# EAGLE schematic V0.2a (EAGLE 8.6.2)

## Sheet 1 of 3: This sheet contain connections for Power Source and +3.3 V regulator to enable communication.
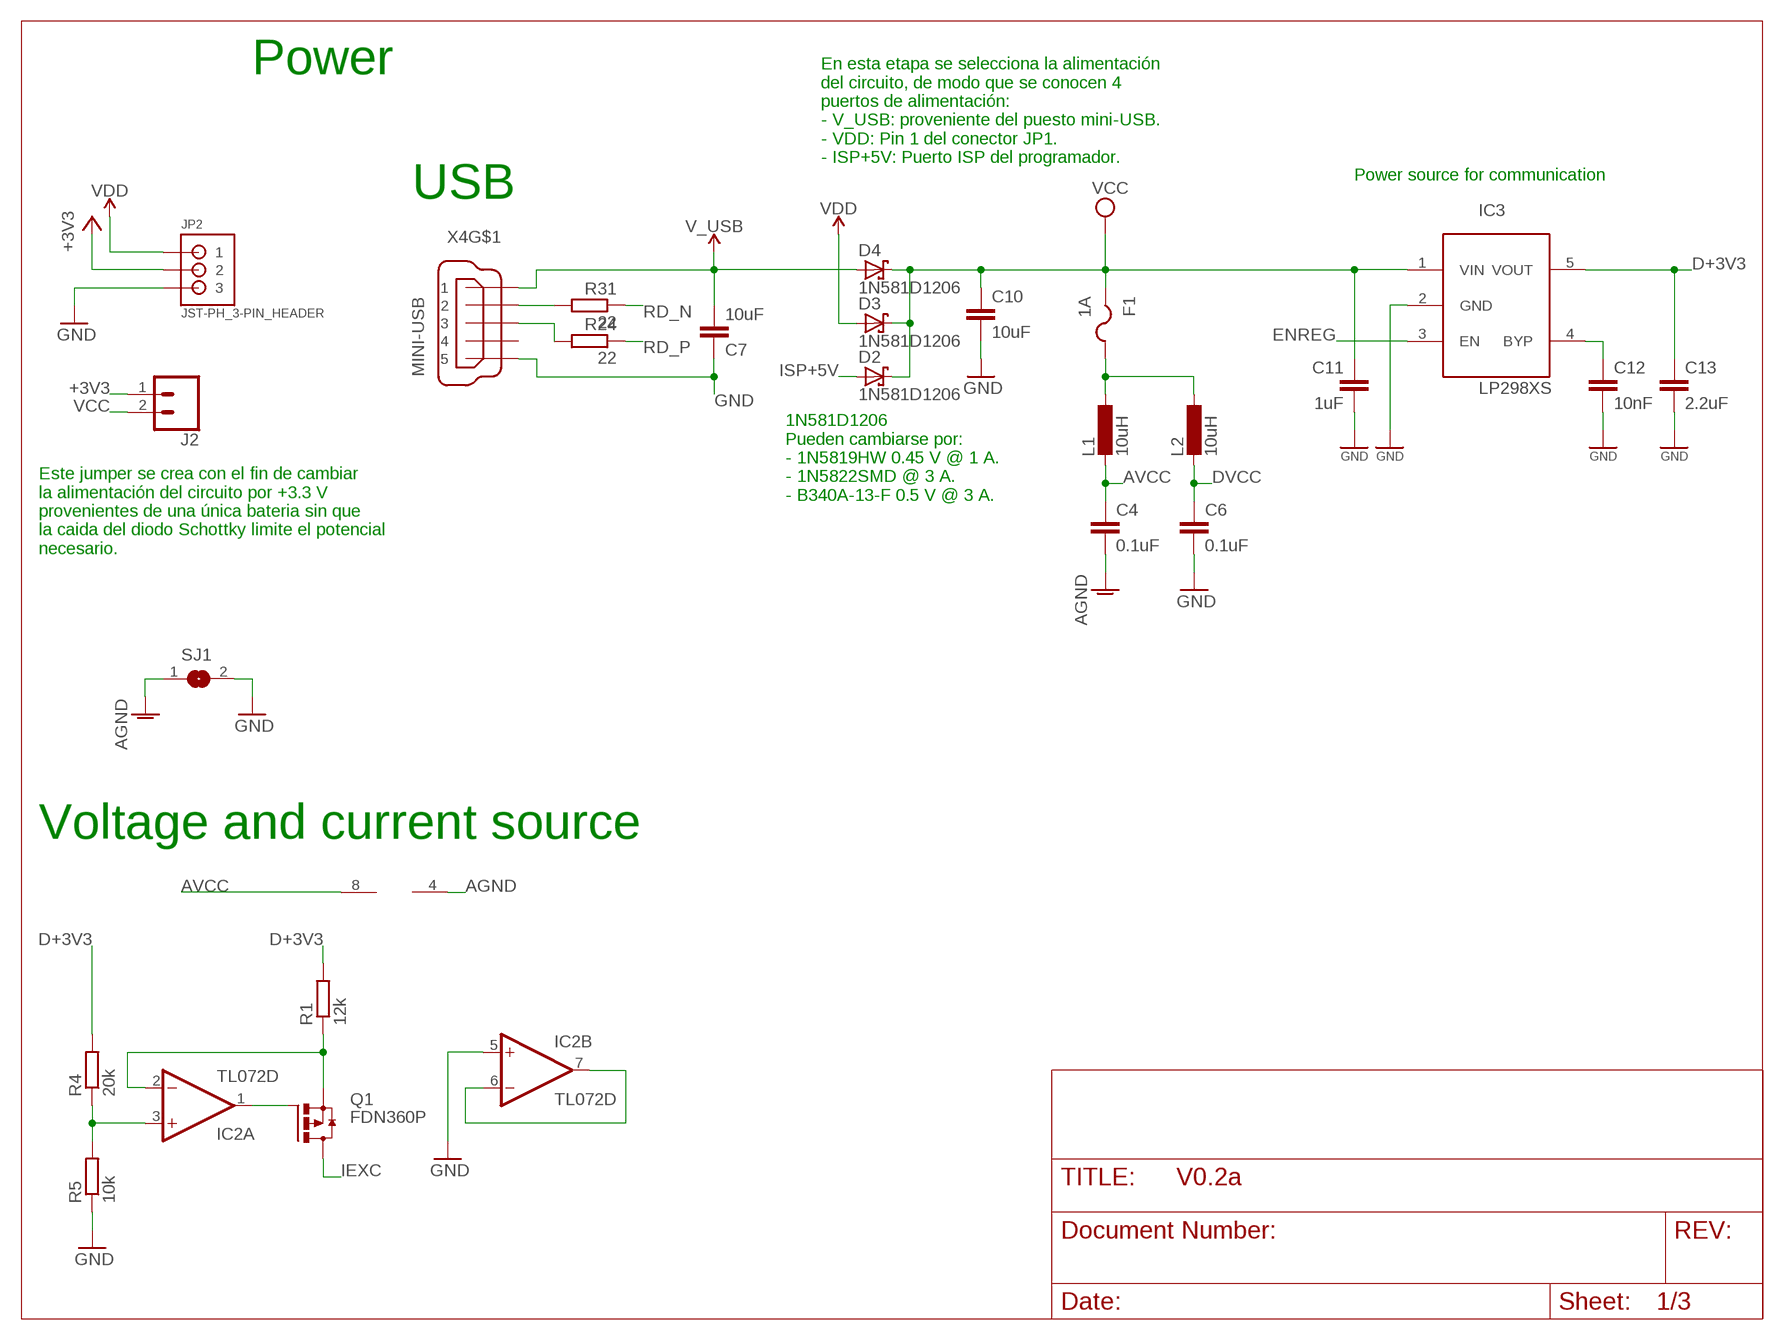
[diagram p0: schematic, sheet 1]

### Parts
C4  0.1uF  C-EUC0805  [C0805]
C6  0.1uF  C-EUC0805  [C0805]
C7  10uF  C-EUC0805  [C0805]
C10  10uF  C-EUC1206  [C1206]
C11  1uF  C-EUC0805  [C0805]
C12  10nF  C-EUC0805  [C0805]
C13  2.2uF  C-EUC0805  [C0805]
D2  1N581D1206  [LED-1206]
D3  1N581D1206  [LED-1206]
D4  1N581D1206  [LED-1206]
F1  1A  PTCFUSE-1812  [1812]
IC2  TL072D  [SO08]
IC3  LP298XS  [SOT23-5L]
J2  CONN_02  [1X02]
JP2  JST-PH_3-PIN_HEADER  [JST_B3B-PH_HEADER]
L1  10uH  L-EUL1812  [L1812]
L2  10uH  L-EUL1812  [L1812]
Q1  FDN360P  [SUPER-SOT3]
R1  12k  R-EU_R0805  [R0805]
R4  20k  R-EU_R0805  [R0805]
R5  10k  R-EU_R0805  [R0805]
R24  22  R-EU_R0805  [R0805]
R31  22  R-EU_R0805  [R0805]
SJ1  SJ  [SJ]
X4  MINI-USB  MINI-USB-SCHIELD-32005-201  [32005-201]

### Nets
+3V3 [power]: J2.1 JP2.P2
AGND: C4.2 IC2.4(P:V-) SJ1.1 ; also sheet 2
AVCC: C4.1 IC2.8(P:V+) L1.2
D+3V3 [power]: C13.1 IC3.5(VOUT) R1.2 R4.2 ; also sheet 2,3
D+USB: R24.2 X4.3
D-USB: R31.2 X4.2
DVCC: C6.1 L2.2 ; also sheet 2,3
ENREG: IC3.3(EN) ; also sheet 3
GND [power]: C6.2 C7.1 C10.2 C11.2 C12.2 C13.2 IC2.5(B:+IN) IC3.2(GND) JP2.P3 R5.1 SJ1.2 X4.5 ; also sheet 2,3
IEXC: Q1.3(D) ; also sheet 2
ISP+5V [power]: D2.A ; also sheet 3
N$1 [power]: F1.2 L1.1 L2.1
N$2: IC2.1(A:OUT) Q1.1(G)
N$4: IC2.3(A:+IN) R4.1 R5.2
N$5: IC2.2(A:-IN) Q1.2(S) R1.1
N$6: C12.1 IC3.4(BYP)
N$8: IC2.6(B:-IN) IC2.7(B:OUT)
RD_N: R31.1 ; also sheet 3
RD_P: R24.1 ; also sheet 3
V_USB [power]: C7.2 D4.A X4.1 ; also sheet 3
VCC [power]: C10.1 C11.1 D2.C D3.C D4.C F1.1 IC3.1(VIN) J2.2 ; also sheet 2
VDD [power]: D3.A JP2.P1
Unconnected: X4.4 X4.M1(S:S1) X4.M2(S:S2) X4.M3(S:S3) X4.M4(S:S4)

### Notes on the sheet
- Power
- En esta etapa se selecciona la alimentación 
  del circuito, de modo que se conocen 4
  puertos de alimentación:
  - V_USB: proveniente del puesto mini-USB.
  - VDD: Pin 1 del conector JP1.
  - ISP+5V: Puerto ISP del programador.
- Power source for communication
- USB
- 1N581D1206
  Pueden cambiarse por:
  - 1N5819HW 0.45 V @ 1 A.
  - 1N5822SMD @ 3 A.
  - B340A-13-F 0.5 V @ 3 A.
- Este jumper se crea con el fin de cambiar 
  la alimentación del circuito por +3.3 V 
  provenientes de una única bateria sin que 
  la caida del diodo Schottky limite el potencial 
  necesario.
- Voltage and current source

## Sheet 2 of 3: This sheet contain all conections for analog and digital sensors, display communication, antenna ports and conductive buttons for local configuration.
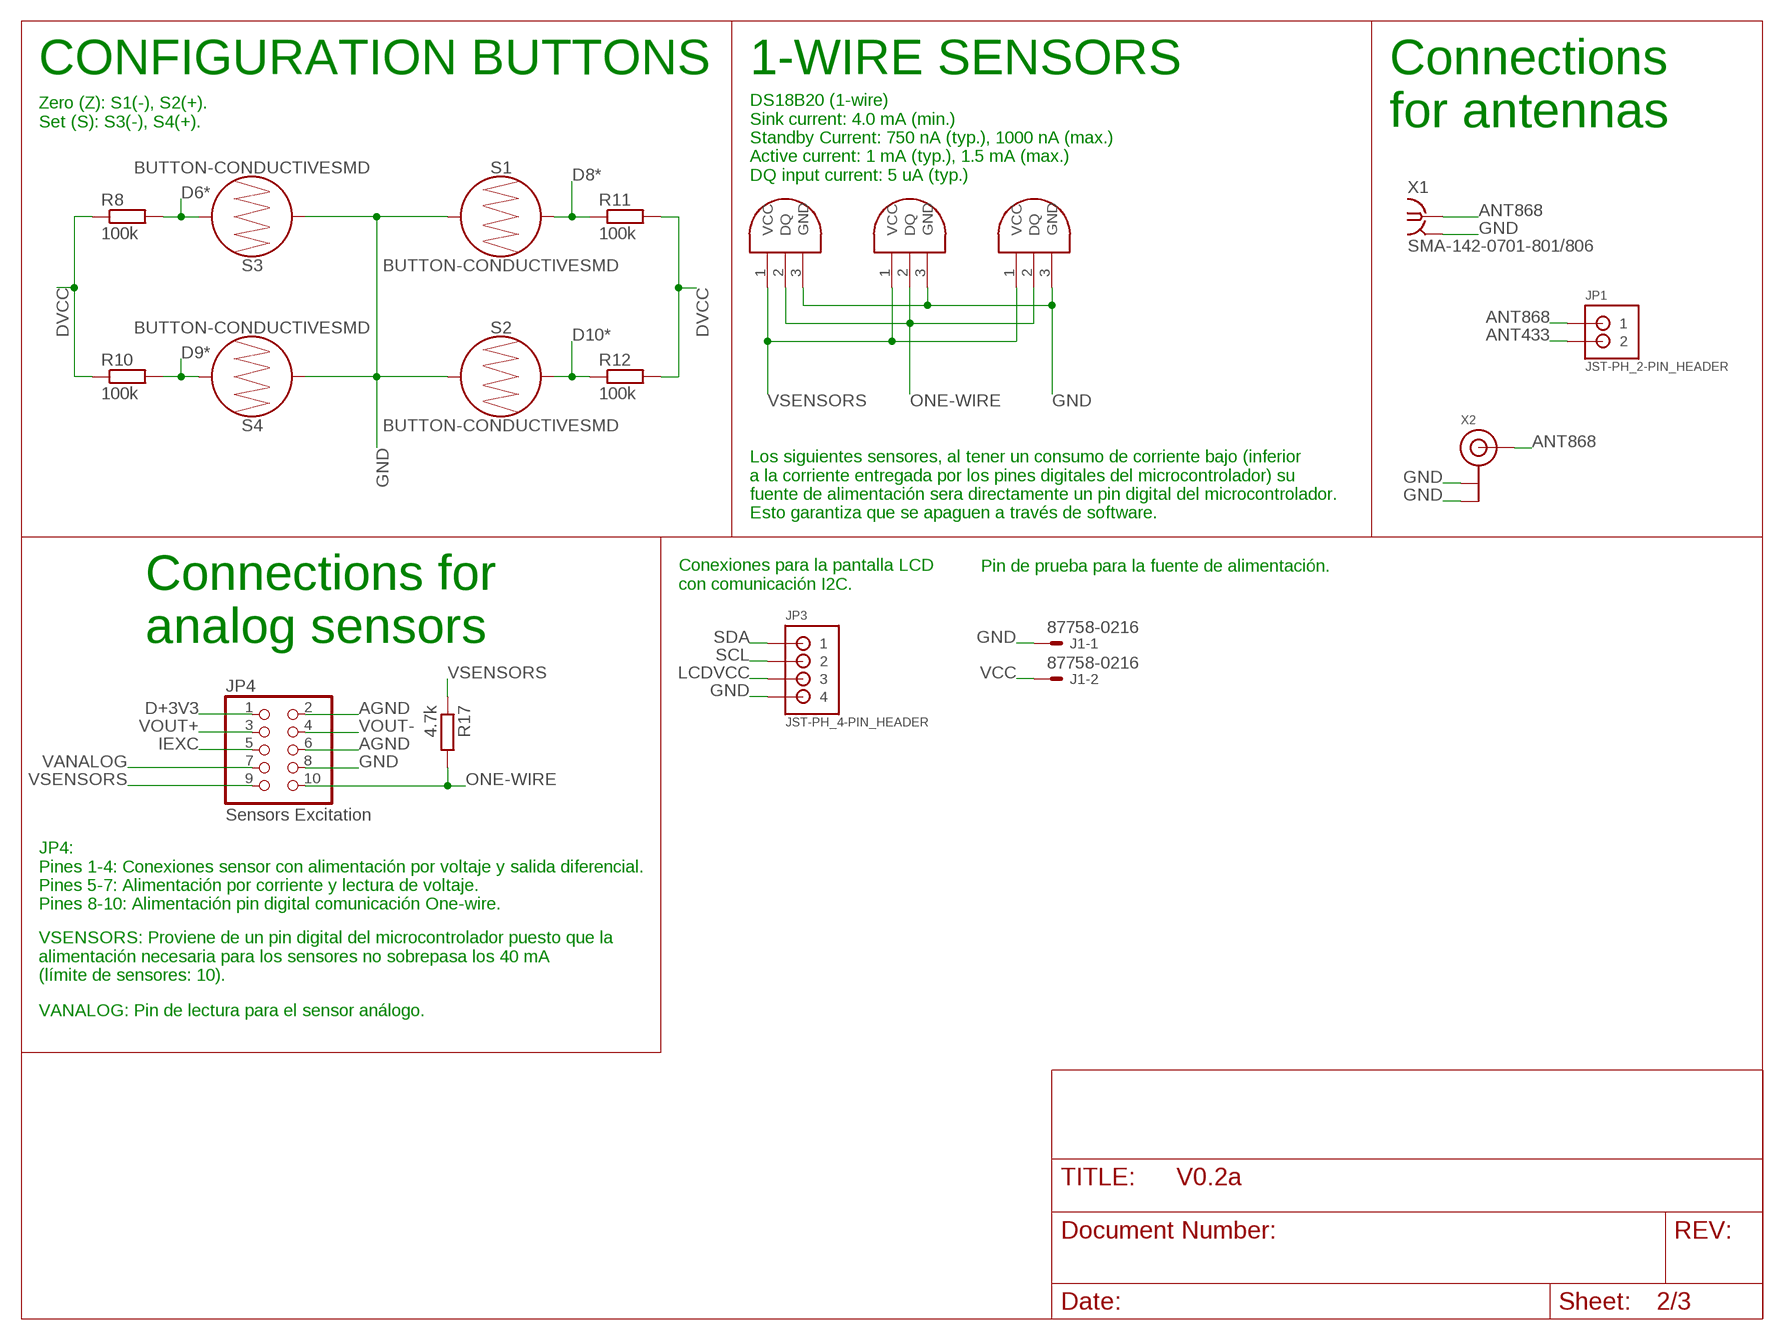
[diagram p1: schematic, sheet 2]

### Parts
J1  87758-0216  [87758-0216]
JP1  JST-PH_2-PIN_HEADER  [JST_B2B-PH_HEADER]
JP3  JST-PH_4-PIN_HEADER  [JST_B4B-PH_HEADER]
JP4  Sensors Excitation  PINHD-2X5/90  [2X05/90]
R8  100k  R-EU_R0805  [R0805]
R10  100k  R-EU_R0805  [R0805]
R11  100k  R-EU_R0805  [R0805]
R12  100k  R-EU_R0805  [R0805]
R17  4.7k  R-EU_R0805  [R0805]
S1  BUTTON-CONDUCTIVESMD  [BUTTON-CONDUCTIVE]
S2  BUTTON-CONDUCTIVESMD  [BUTTON-CONDUCTIVE]
S3  BUTTON-CONDUCTIVESMD  [BUTTON-CONDUCTIVE]
S4  BUTTON-CONDUCTIVESMD  [BUTTON-CONDUCTIVE]
U$5  DS18B20_PINS  [3PINS_SMALL]
U$6  DS18B20_PINS  [3PINS_SMALL]
U$9  DS18B20_PINS  [3PINS_SMALL]
X1  SMA-142-0701-801/806  [J502-ND-142-0701-801/806]
X2  ANTENNA_U.FL  [U.FL]

### Nets
AGND: JP4.2 JP4.6 ; also sheet 1
ANT433: JP1.P2 ; also sheet 3
ANT868: JP1.P1 X1.1 X2.3(SIGNAL) ; also sheet 3
D6*: R8.2 S3.2 ; also sheet 3
D8*: R11.1 S1.2 ; also sheet 3
D9*: R10.2 S4.2 ; also sheet 3
D10*: R12.1 S2.2 ; also sheet 3
D+3V3 [power]: JP4.1 ; also sheet 1,3
DVCC: R8.1 R10.1 R11.2 R12.2 ; also sheet 1,3
GND [power]: J1.1 JP3.P4 JP4.8 S1.1 S2.1 S3.1 S4.1 U$5.3(GND) U$6.3(GND) U$9.3(GND) X1.G@1 X1.G@2 X1.G@3 X1.G@4 X2.1(GND) X2.2(GND) ; also sheet 1,3
IEXC: JP4.5 ; also sheet 1
LCDVCC [power]: JP3.P3 ; also sheet 3
ONE-WIRE: JP4.10 R17.2 U$5.2(DQ) U$6.2(DQ) U$9.2(DQ) ; also sheet 3
SCL: JP3.P2 ; also sheet 3
SDA: JP3.P1 ; also sheet 3
VANALOG: JP4.7 ; also sheet 3
VCC [power]: J1.2 ; also sheet 1
VOUT+: JP4.3 ; also sheet 3
VOUT-: JP4.4 ; also sheet 3
VSENSORS: JP4.9 R17.1 U$5.1(VCC) U$6.1(VCC) U$9.1(VCC) ; also sheet 3

### Notes on the sheet
- CONFIGURATION BUTTONS | 1-WIRE SENSORS
- Zero (Z): S1(-), S2(+).
  Set (S): S3(-), S4(+).
- Connections 
  for antennas
- DS18B20 (1-wire)
  Sink current: 4.0 mA (min.)
  Standby Current: 750 nA (typ.), 1000 nA (max.)
  Active current: 1 mA (typ.), 1.5 mA (max.)
  DQ input current: 5 uA (typ.)
- Los siguientes sensores, al tener un consumo de corriente bajo (inferior 
  a la corriente entregada por los pines digitales del microcontrolador) su 
  fuente de alimentación sera directamente un pin digital del microcontrolador. 
  Esto garantiza que se apaguen a través de software.
- Pin de prueba para la fuente de alimentación.
- Conexiones para la pantalla LCD
  con comunicación I2C.
- Connections for
  analog sensors
- JP4:
  Pines 1-4: Conexiones sensor con alimentación por voltaje y salida diferencial.
  Pines 5-7: Alimentación por corriente y lectura de voltaje.
  Pines 8-10: Alimentación pin digital comunicación One-wire.
- VSENSORS: Proviene de un pin digital del microcontrolador puesto que la 
  alimentación necesaria para los sensores no sobrepasa los 40 mA 
  (límite de sensores: 10).
- VANALOG: Pin de lectura para el sensor análogo.

## Sheet 3 of 3: This sheet contain all the configuration neccesary for microcontroller ATmega32u4. All conections about source, reset and external clocks was included here.
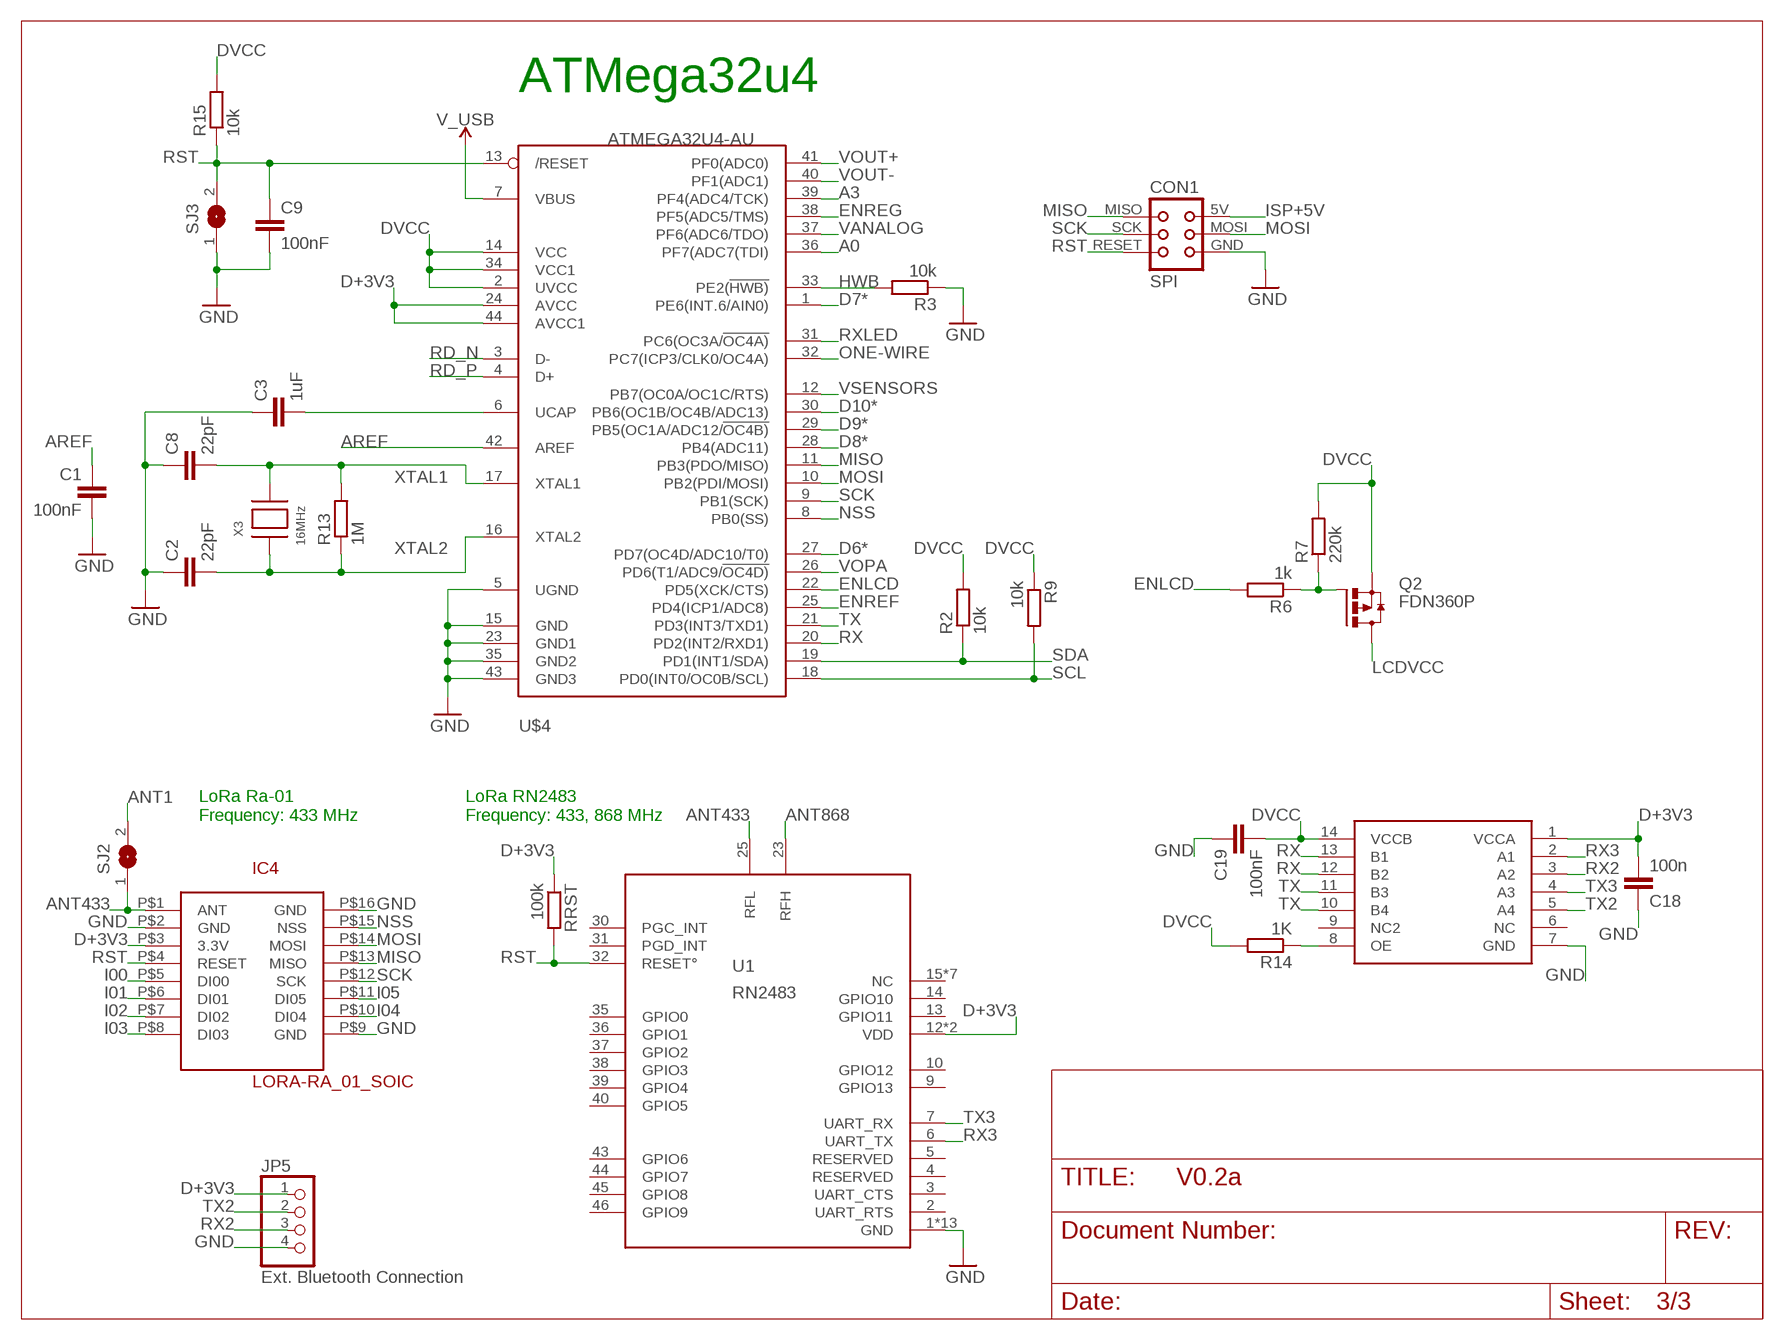
[diagram p2: schematic, sheet 3]

### Parts
C1  100nF  C-EUC0805  [C0805]
C2  22pF  C-EUC0805  [C0805]
C3  1uF  C-EUC0805  [C0805]
C8  22pF  C-EUC0805  [C0805]
C9  100nF  C-EUC0805  [C0805]
C18  100n  C-EUC0805  [C0805]
C19  100nF  C-EUC0805  [C0805]
CON1  SPI  TINYISPT  [TC2030-MCP-NL]
IC4  LORA-RA_01_SOIC  [LORA-RA_01]
JP5  Ext. Bluetooth Connection  PINHD-1X4  [1X04]
Q2  FDN360P  [SUPER-SOT3]
R2  10k  R-EU_R0805  [R0805]
R3  10k  R-EU_R0805  [R0805]
R6  1k  R-EU_R0805  [R0805]
R7  220k  R-EU_R0805  [R0805]
R9  10k  R-EU_R0805  [R0805]
R13  1M  R-EU_R0805  [R0805]
R14  1K  R-EU_R0805  [R0805]
R15  10k  R-EU_M0805  [M0805]
RRST  100k  R-EU_R0805  [R0805]
SJ2  SJ  [SJ]
SJ3  SJ  [SJ]
U1  RN2483  [RN2483]
U$3  TXB0104  [SO14]
U$4  ATMEGA32U4-AU  [TQFP44]
X3  16MHz  XTALNX6035  [NX6035]

### Nets
A0: U$4.36(PF7(ADC7(TDI))
A3: U$4.39(PF4(ADC4/TCK))
ANT1: SJ2.2
ANT433: IC4.P$1(ANT) SJ2.1 U1.25(RFL) ; also sheet 2
ANT868: U1.23(RFH) ; also sheet 2
AREF: C1.1 U$4.42(AREF)
D6*: U$4.27(PD7(OC4D/ADC10/T0)) ; also sheet 2
D7*: U$4.1(PE6(INT.6/AIN0))
D8*: U$4.28(PB4(ADC11)) ; also sheet 2
D9*: U$4.29(PB5(OC1A/ADC12/!OC4B)) ; also sheet 2
D10*: U$4.30(PB6(OC1B/OC4B/ADC13)) ; also sheet 2
D+3V3 [power]: C18.2 IC4.P$3(3.3V) JP5.1 RRST.1 U1.12(VDD) U1.34(VDD) U$3.1(VCCA) U$4.24(AVCC) U$4.44(AVCC1) ; also sheet 1,2
DVCC: C19.2 Q2.2(S) R2.2 R7.2 R9.1 R14.2 R15.2 U$3.14(VCCB) U$4.2(UVCC) U$4.14(VCC) U$4.34(VCC1) ; also sheet 1,2
ENLCD: R6.2 U$4.22(PD5(XCK/CTS))
ENREF: U$4.25(PD4(ICP1/ADC8))
ENREG: U$4.38(PF5(ADC5/TMS)) ; also sheet 1
GND [power]: C1.2 C2.1 C3.1 C8.1 C9.2 C18.1 C19.1 CON1.GND IC4.P$2(GND) IC4.P$9(GND) IC4.P$16(GND) JP5.4 R3.1 SJ3.1 U1.1(GND) U1.8(GND) U1.11(GND) U1.20(GND) U1.21(GND) U1.22(GND) U1.24(GND) U1.26(GND) U1.27(GND) U1.28(GND) U1.33(GND) U1.41(GND) U1.47(GND) U$3.7(GND) U$4.5(UGND) U$4.15(GND) U$4.23(GND1) U$4.35(GND2) U$4.43(GND3) ; also sheet 1,2
HWB: R3.2 U$4.33(PE2(!HWB))
I00: IC4.P$5(DI00)
I01: IC4.P$6(DI01)
I02: IC4.P$7(DI02)
I03: IC4.P$8(DI03)
I04: IC4.P$10(DI04)
I05: IC4.P$11(DI05)
ISP+5V [power]: CON1.5V(VCC) ; also sheet 1
LCDVCC [power]: Q2.3(D) ; also sheet 2
MISO: CON1.MISO IC4.P$13(MISO) U$4.11(PB3(PDO/MISO))
MOSI: CON1.MOSI IC4.P$14(MOSI) U$4.10(PB2(PDI/MOSI))
N$3: R14.1 U$3.8(OE)
N$7: Q2.1(G) R6.1 R7.1
NSS: IC4.P$15(NSS) U$4.8(PB0(SS))
ONE-WIRE: U$4.32(PC7(ICP3/CLK0/OC4A)) ; also sheet 2
RD_N: U$4.3(D-) ; also sheet 1
RD_P: U$4.4(D+) ; also sheet 1
RST: C9.1 CON1.RESET IC4.P$4(RESET) R15.1 RRST.2 SJ3.2 U1.32(RESET°) U$4.13(/RESET)
RX: U$3.12(B2) U$3.13(B1) U$4.20(PD2(INT2/RXD1))
RX2: JP5.3 U$3.3(A2)
RX3: U1.6(UART_TX) U$3.2(A1)
RXLED: U$4.31(PC6(OC3A/!OC4A))
SCK: CON1.SCK IC4.P$12(SCK) U$4.9(PB1(SCK))
SCL: R9.2 U$4.18(PD0(INT0/OC0B/SCL)) ; also sheet 2
SDA: R2.1 U$4.19(PD1(INT1/SDA)) ; also sheet 2
TX: U$3.10(B4) U$3.11(B3) U$4.21(PD3(INT3/TXD1))
TX2: JP5.2 U$3.5(A4)
TX3: U1.7(UART_RX) U$3.4(A3)
UCAP: C3.2 U$4.6(UCAP)
V_USB [power]: U$4.7(VBUS) ; also sheet 1
VANALOG: U$4.37(PF6(ADC6/TDO)) ; also sheet 2
VOPA: U$4.26(PD6(T1/ADC9/!OC4D))
VOUT+: U$4.41(PF0(ADC0)) ; also sheet 2
VOUT-: U$4.40(PF1(ADC1)) ; also sheet 2
VSENSORS: U$4.12(PB7(OC0A/OC1C/RTS)) ; also sheet 2
XTAL1: C8.2 R13.2 U$4.17(XTAL1) X3.P$2
XTAL2: C2.2 R13.1 U$4.16(XTAL2) X3.P$1
Unconnected: U1.2(UART_RTS) U1.3(UART_CTS) U1.4(RESERVED) U1.5(RESERVED) U1.9(GPIO13) U1.10(GPIO12) U1.13(GPIO11) U1.14(GPIO10) U1.15(NC) U1.16(NC) U1.17(NC) U1.18(NC) U1.19(NC) U1.29(NC) U1.30(PGC_INT) U1.31(PGD_INT) U1.35(GPIO0) U1.36(GPIO1) U1.37(GPIO2) U1.38(GPIO3) U1.39(GPIO4) U1.40(GPIO5) U1.42(NC) U1.43(GPIO6) U1.44(GPIO7) U1.45(GPIO8) U1.46(GPIO9) U$3.6(NC) U$3.9(NC2)

### Notes on the sheet
- ATMega32u4
- LoRa Ra-01
  Frequency: 433 MHz
- LoRa RN2483
  Frequency: 433, 868 MHz

## Library data of the parts
C1 C3 C4 C6-C9 C11-C13 C18 C19 = rcl:C-EU: CAPACITOR, European symbol; SPICEPREFIX: C
C2 C10 = rcl:C-EU: CAPACITOR, European symbol
CON1 = lpatiny:TINYISP: CONNECTOR
D2-D4 = lpatiny:1N581*: 1.0A SCHOTTKY BARRIER RECTIFIER Source: http://www.diodes.com/datasheets/ds23001.pdf
F1 = adafruit:PTCFUSE: PTC fuses, resettable thermistors
IC2 = linear:TL072: OP AMP; SPICEPREFIX: J
IC3 = adafruit:LP298X
IC4 = LORA-RA_01:LORA-RA_01_SOIC
J1 = con-molex:87758-0216: 2 Pin - 2mm Dual Row Single Wafer, Vertical T/H HDR Source: http://www.molex.com/pdm_docs/sd/877580616_sd.pdf; MF: MOLEX; MPN: 87758-0216; OC_FARNELL: unknown; OC_NEWARK: 94M1513
J2 = SparkFun-Connectors:CONN_02: Multi connection point. Often used as Generic Header-pin footprint for 0.1 inch spaced/style header connections On any of the 0.1 inch spaced packages, you can populate with these: Break Away Headers - Straight <https://www.sparkfun.com/products/116> (PRT-00116) Break Away Male Headers - Right Angle <https://www.sparkfun.com/products/553> (PRT-00553) Female Headers <https://www.sparkfun.com/products/115> (PRT-00115) Break Away Headers - Machine Pin <https://www.sparkfun.com/products/117> (PRT-00117) Break Away Female Headers - Swiss Machine Pin <https://www.sparkfun.com/products/743> (PRT-00743) For SCREWTERMINALS and SPRING TERMINALS visit here: Screw Terimnals on SparkFun.com <https://www.sparkfun.com/search/results?term=Screw+Terminals> (5mm/3.5mm/2.54mm spacing) This device is also useful as a general connection point to wire up your design to another part of your project. Our various solder wires solder well into these plated through hole pads. Hook-Up Wire - Assortment (Stranded, 22 AWG) <https://www.sparkfun.com/products/11375> (PRT-11375) Hook-Up Wire - Assortment (Solid Core, 22 AWG) <https://www.sparkfun.com/products/11367> (PRT-11367) View the entire wire category on our website here <https://www.sparkfun.com/categories/141> Special notes: Molex polarized connector foot print use with: PRT-08233 with associated crimp pins and housings. 2.54_SCREWTERM for use with PRT-10571. 3.5mm Screw Terminal footprints for PRT-08084 5mm Screw Terminal footprints for use with PRT-08432
JP1 = SRG:JST-PH_2-PIN_HEADER: 2-pin JST PH Shrouded Header, top entry P/N B2B-PH-K-S Mating connector PHR-2 Mating cable assembly: Sparkfun PRT-09914 <http://www.sparkfun.com/products/9914>
JP2 = SRG:JST-PH_3-PIN_HEADER: 3-pin JST PH Shrouded Header, top entry P/N B3B-PH-K-S Mating connector PHR-3
JP3 = SRG:JST-PH_4-PIN_HEADER: 4-pin JST PH Shrouded Header, top entry P/N B4B-PH-K-S Mating connector PHR-4 Mating cable assembly: Sparkfun PRT-09916 <http://www.sparkfun.com/products/9916>
JP4 = pinhead:PINHD-2X5: PIN HEADER
JP5 = pinhead:PINHD-1X4: PIN HEADER
L1 L2 = rcl:L-EU: INDUCTOR, European symbol; SPICEPREFIX: L
Q1 Q2 = transistor-power:FDN360P: Single P-Channel, PowerTrench (R) MOSFET Source: http://www.fairchildsemi.com/ds/FD/FDN360P.pdf
R1-R13 R17 R24 R31 = rcl:R-EU_: RESISTOR, European symbol; SPICEPREFIX: R
R14 RRST = rcl:R-EU_: RESISTOR, European symbol
R15 = resistor:R-EU_: RESISTOR, European symbol
S1-S4 = SparkFun-Switches:BUTTON-CONDUCTIVE: Conductive Button Used with rubber key pads on the Nordic Key FOB <https://www.sparkfun.com/products/retired/8602>. This one was designed and proven to work with the PolyCase Key FOB enclosures <https://www.sparkfun.com/products/retired/9377>. SparkFun Products Nordic Fob <https://www.sparkfun.com/products/retired/8602> (WRL-08602)
SJ1-SJ3 = jumper:SJ: SMD solder JUMPER
U1 = tobias:RN2483: RN2483 Microchip Low-Power Lora Transceiver Module NOT TESTED There are testpads on the bottom of the device. The mask is supposed to cover that, but I have not tested it in practice yet. Info: http://www.microchip.com/wwwproducts/Devices.aspx?product=RN2483 Datasheet: http://ww1.microchip.com/downloads/en/DeviceDoc/50002346B.pdf Adapted from: https://github.com/Octanis1/Octanis1-Electronics/blob/ae493cac28c100e20856abe563dfe8824e9cc4bd/lib/Octanis1.lbr
U$3 = lpatiny:TXB0104: TXB0104 4-Bit Bidirectional Voltage-level Translator With Automatic Direction Sensing and ±15-kV ESD Protection
U$4 = adafruit:ATMEGA32U4: http://www.ladyada.net/library/eagle
U$5 U$6 U$9 = lpatiny:DS18B20_PINS
X1 = con-coax:SMA-: SMA 50 Ohm End Launch Jack Receptacle - Round Contact Johnson Components Source: www.johnsoncomponents.com .. J502-ND.pdf; MF: JOHNSON COMPONENTS; MPN: 142-0701-801; OC_FARNELL: 1608592; OC_NEWARK: 90F2624
X2 = adafruit:ANTENNA_U.FL: U.FL Antenna Connector
X3 = lpatiny:XTAL: Low cost SMT crystals, no capacitors included http://www.ladyada.net/library/eagle
X4 = con-cypressindustries:MINI-USB-SCHIELD-: MINI USB-B Conector Source: www.cypressindustries.com; OC_FARNELL: unknown; OC_NEWARK: unknown

## Net classes
0 default: width 0.203 mm
1 power: width 0.203 mm, drill 0.305 mm, clearance 0.152 mm
2 VIN: width 0.457 mm
3 fine: width 0.305 mm
4 aref: width 0.305 mm